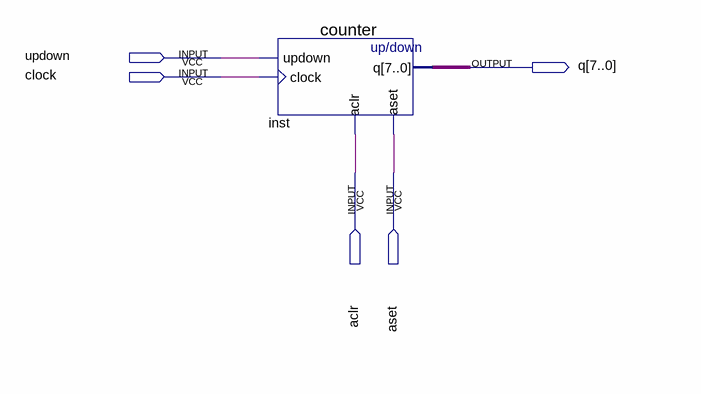
[diagram p0: schematic sheet]
// Quartus schematic contador.bdf as structural Verilog: 1 symbols, 5 pins
module contador (
  input  updown,
  input  clock,
  input  aclr,
  input  aset,
  output [7:0] q
);

  counter inst (.updown(updown), .clock(clock), .aclr(aclr), .aset(aset), .q(q));
endmodule
